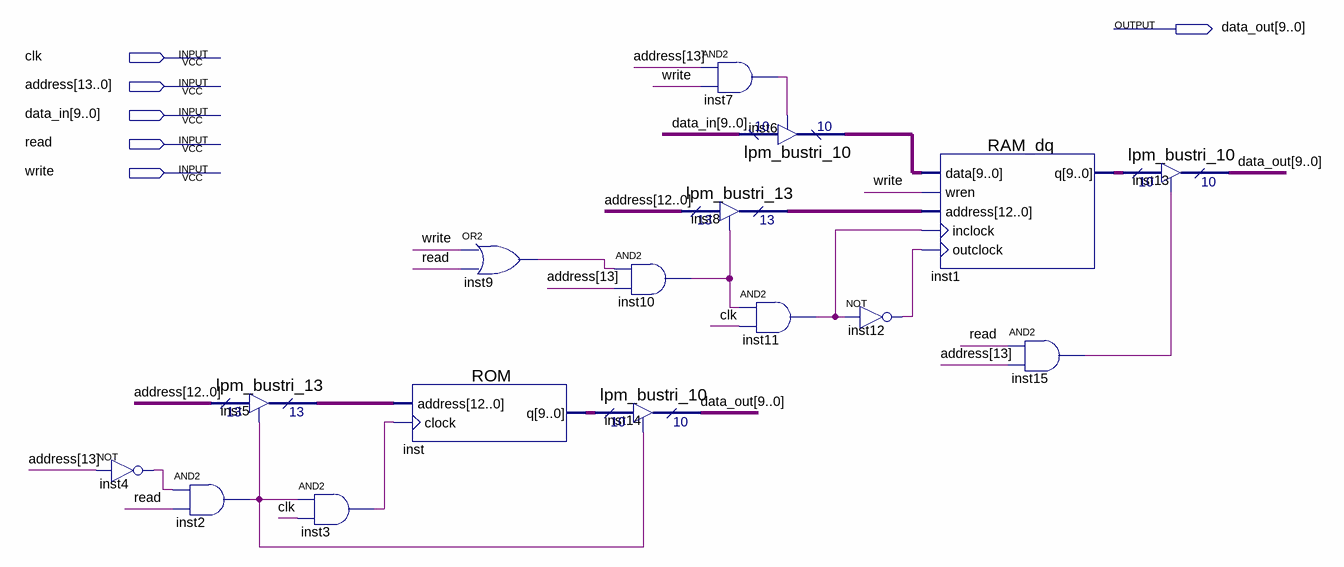
[diagram p0: schematic sheet]
// Quartus schematic memory.bdf as structural Verilog: 16 symbols, 6 pins
module memory (
  input  clk,
  input  [13:0] address,
  input  [9:0] data_in,
  input  read,
  input  write,
  output [9:0] data_out
);

  wire inst2_out, inst3_out, inst4_out, inst7_out, inst9_out, inst10_out, inst11_out, inst12_out, inst15_out;
  wire [9:0] inst1_q, inst6_tridata, inst_q;
  wire [12:0] inst5_tridata, inst8_tridata;

  not inst4 (inst4_out, address[13]);
  and inst2 (inst2_out, inst4_out, read);
  lpm_bustri_13 inst5 (.enabledt(inst2_out), .data(address[12:0]), .tridata(inst5_tridata));
  and inst3 (inst3_out, inst2_out, clk);
  ROM inst (.address(inst5_tridata), .clock(inst3_out), .q(inst_q));
  or inst9 (inst9_out, write, read);
  and inst10 (inst10_out, inst9_out, address[13]);
  lpm_bustri_10 inst14 (.enabledt(inst2_out), .data(inst_q), .tridata(data_out));
  and inst7 (inst7_out, address[13], write);
  lpm_bustri_13 inst8 (.enabledt(inst10_out), .data(address[12:0]), .tridata(inst8_tridata));
  lpm_bustri_10 inst6 (.enabledt(inst7_out), .data(data_in), .tridata(inst6_tridata));
  and inst11 (inst11_out, inst10_out, clk);
  not inst12 (inst12_out, inst11_out);
  RAM_dq inst1 (
    .data(inst6_tridata), .wren(write), .address(inst8_tridata), .inclock(inst11_out), .outclock(inst12_out),
    .q(inst1_q));
  and inst15 (inst15_out, read, address[13]);
  lpm_bustri_10 inst13 (.enabledt(inst15_out), .data(inst1_q), .tridata(data_out));
endmodule
